# EAGLE design HCSR04_RingSection_C (EAGLE 8.4.3)
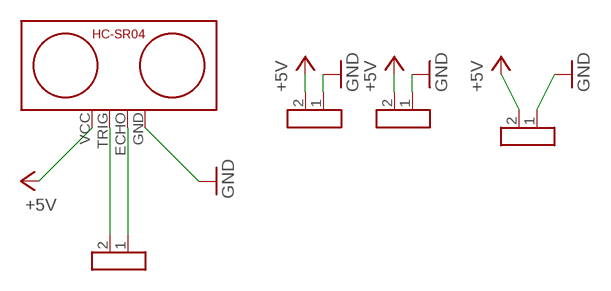
[diagram p0: schematic, sheet 1]

## Parts
U$1  HCSR04  [HCSR04]
U$2  2XHEADER  [2XHEADER]
U$3  2XHEADER  [2XHEADER]
U$4  2XHEADER  [2XHEADER]
U$6  2XHEADER  [2XHEADER]

## Nets
+5V: U$1.VCC U$2.2 U$3.2 U$6.2
ECHO: U$1.ECHO U$4.1
GND: U$1.GND U$2.1 U$3.1 U$6.1
TRIG: U$1.TRIG U$4.2

## Library data of the parts
U$1 = Richard_Boards:HCSR04
U$2-U$4 U$6 = Richard_Headers:2XHEADER

## Net classes
0 default: width 0.254 mm

## Board
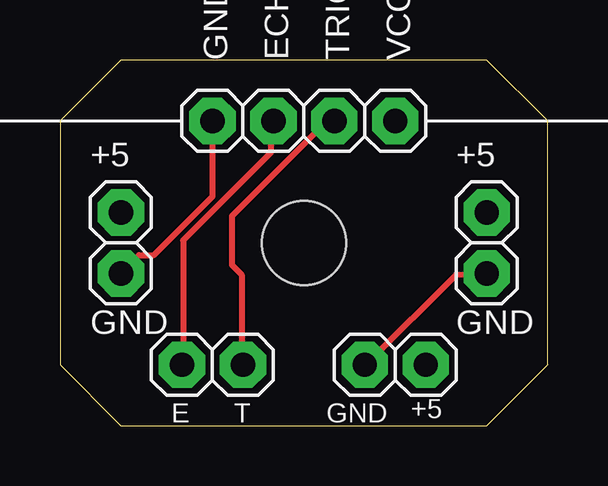
[diagram p1: board, top side]
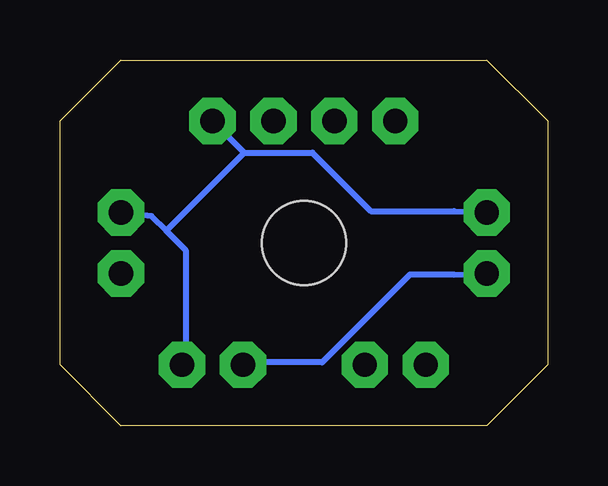
[diagram p2: board, bottom side, seen from below]

Size 20.32 x 15.24 mm. Coordinates in mm from the lower left corner, seen from the top.
Outline: 2.54,0 17.78,0 20.32,2.54 20.32,12.7 17.78,15.24 2.54,15.24 0,12.7 0,2.54 2.54,0
Copper layers (1*16): Top 0.035mm / dielectric 1.5mm / Bottom 0.035mm
Design rules "default": minimum track width 6mil, minimum drill 0.35mm, track to track 6mil, track to pad 6mil, pad to pad 6mil, via to via 6mil, smd to smd 6mil, copper to edge 40mil, drill to drill 6mil, minimum pad ring 10mil, minimum via ring 8mil, stop-mask expansion 4mil, vias tented up to drill 0mil, thermal gap 10mil

### Footprints (pad centres in the part's own frame; a part is rotated, then mirrored left to right if it is on the bottom)
HCSR04 = drill 1.016 pad 1.93 octagon: ECHO -1.27,0; GND -3.81,0; TRIG 1.27,0; VCC 3.81,0
2XHEADER = drill 1.016 pad 1.93 octagon: 1 0,1.27; 2 0,-1.27
632 = hole 3.5: 0,0

### Placement (x,y rotation side)
U$1  10.16,12.7 0 top
U$2  17.78,7.62 180 top
U$3  2.54,7.62 180 top
U$4  6.35,2.54 90 top
U$5  [632]  10.16,7.62 0 top
U$6  13.97,2.54 90 top

### Tracks (layer width: path | path; a pad name or v marks a point on that pad's centre or on a via)
+5V
  Bottom 0.254: 15.9,8.13 16.51,8.74 U$2.2 | 15.9,8.13 15.09,7.32 15.09,2.64 U$6.2 | 12.65,11.38 9.8,11.38 7.37,8.94 3.91,8.94 U$3.2 | U$1.VCC 12.65,11.38 | 12.65,11.38 15.9,8.13
ECHO
  Top 0.254: U$4.1 5.13,2.64 5.13,7.72 8.79,11.38 8.79,12.6 U$1.ECHO
GND
  Top 0.254: U$6.1 12.85,2.64 16.51,6.3 U$2.1 | U$1.GND 6.35,9.55 3.91,7.11 3.3,7.11 U$3.1
  Bottom 0.254: U$6.1 12.65,2.64 9.4,2.64 5.74,6.3 3.91,6.3 U$3.1
TRIG
  Top 0.254: U$4.2 7.57,2.64 7.57,6.3 7.16,6.71 7.16,8.74 11.02,12.6 11.43,12.6 U$1.TRIG

### Text on the board
tPlace: +5 | +5 | GND | GND | E | T | GND | +5